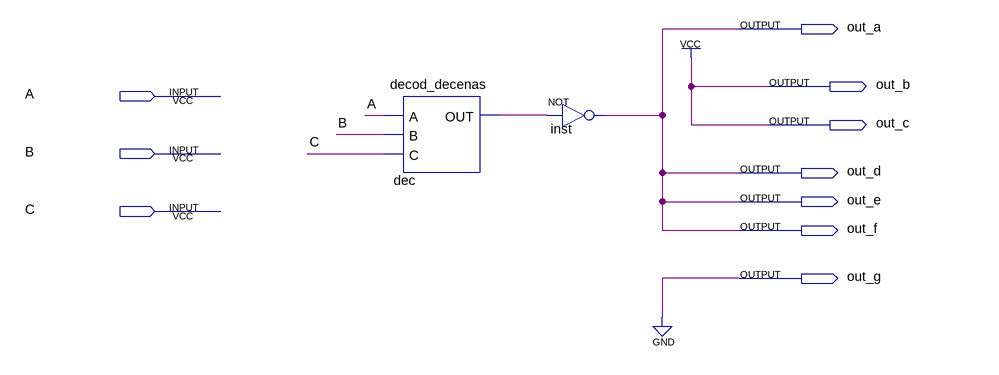
[diagram p0: schematic sheet]
// Quartus schematic decod_2.bdf as structural Verilog: 2 symbols, 10 pins
module decod_2 (
  input  A,
  input  B,
  input  C,
  output out_a,
  output out_b,
  output out_c,
  output out_d,
  output out_e,
  output out_f,
  output out_g
);

  wire dec_out;

  decod_decenas dec (.A(A), .B(B), .C(C), .OUT(dec_out));
  not inst (out_a, dec_out);

  assign out_b = 1'b1;
  assign out_c = 1'b1;
  assign out_d = out_a;
  assign out_e = out_a;
  assign out_f = out_a;
  assign out_g = 1'b0;
endmodule
